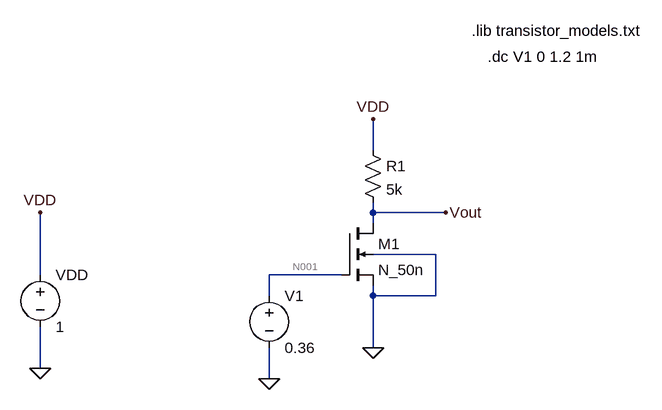
[diagram p0: schematic cs_design.asc]
cs_design.asc, the LTspice schematic file:
Version 4
SHEET 1 880 680
WIRE 352 -64 352 -112
WIRE 352 32 352 16
WIRE 464 32 352 32
WIRE 352 48 352 32
WIRE 448 96 352 96
WIRE -160 128 -160 32
WIRE 304 128 192 128
WIRE 192 160 192 128
WIRE 352 160 352 144
WIRE 448 160 448 96
WIRE 448 160 352 160
WIRE 352 240 352 160
WIRE -160 272 -160 208
WIRE 192 288 192 240
FLAG -160 272 0
FLAG -160 32 VDD
FLAG 192 288 0
FLAG 352 240 0
FLAG 352 -112 VDD
FLAG 464 32 Vout
SYMBOL voltage -160 112 R0
WINDOW 123 0 0 Left 0
WINDOW 39 0 0 Left 0
SYMATTR InstName VDD
SYMATTR Value 1
SYMBOL nmos4 304 48 R0
SYMATTR InstName M1
SYMATTR Value N_50n
SYMATTR Value2 l=100n w=12u
SYMBOL voltage 192 144 R0
WINDOW 123 24 124 Left 2
WINDOW 39 0 0 Left 0
SYMATTR InstName V1
SYMATTR Value 0.36
SYMBOL res 336 -80 R0
SYMATTR InstName R1
SYMATTR Value 5k
TEXT 504 -248 Left 2 !.lib transistor_models.txt
TEXT 528 -208 Left 2 !.dc V1 0 1.2 1m

The netlist it stands for:
* cs_design.asc
VDD VDD 0 1
M1 Vout N001 0 0 N_50n l=100n w=12u
V1 N001 0 0.36
R1 VDD Vout 5k
.model NMOS NMOS
.model PMOS PMOS
.lib standard.mos
.lib transistor_models.txt
.dc V1 0 1.2 1m
.backanno
.end

* Results of the author's LTspice run, read from the files saved beside the schematic
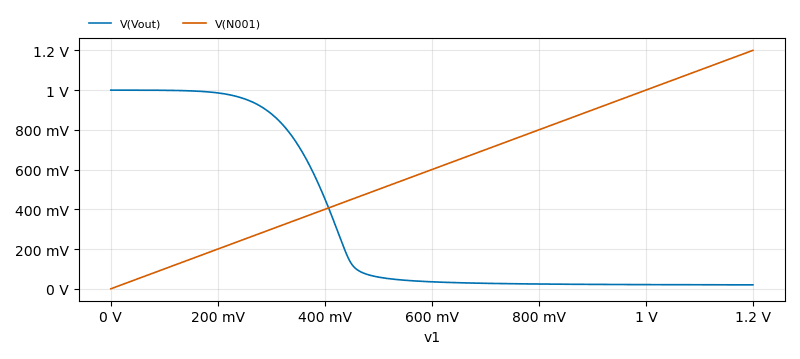
[diagram p1: DC transfer characteristic of cs_design.asc, plotted from the saved traces]
* DC transfer characteristic, 1 run:
*   V(Vout): 999.9 mV at v1=0 V, 19.91 mV at v1=1.2 V, min 19.91 mV, max 999.9 mV
*   V(N001): 0 V at v1=0 V, 1.2 V at v1=1.2 V, min 0 V, max 1.2 V